# Altium schematic sheet STM32.SchDoc
size 297 x 210 mm
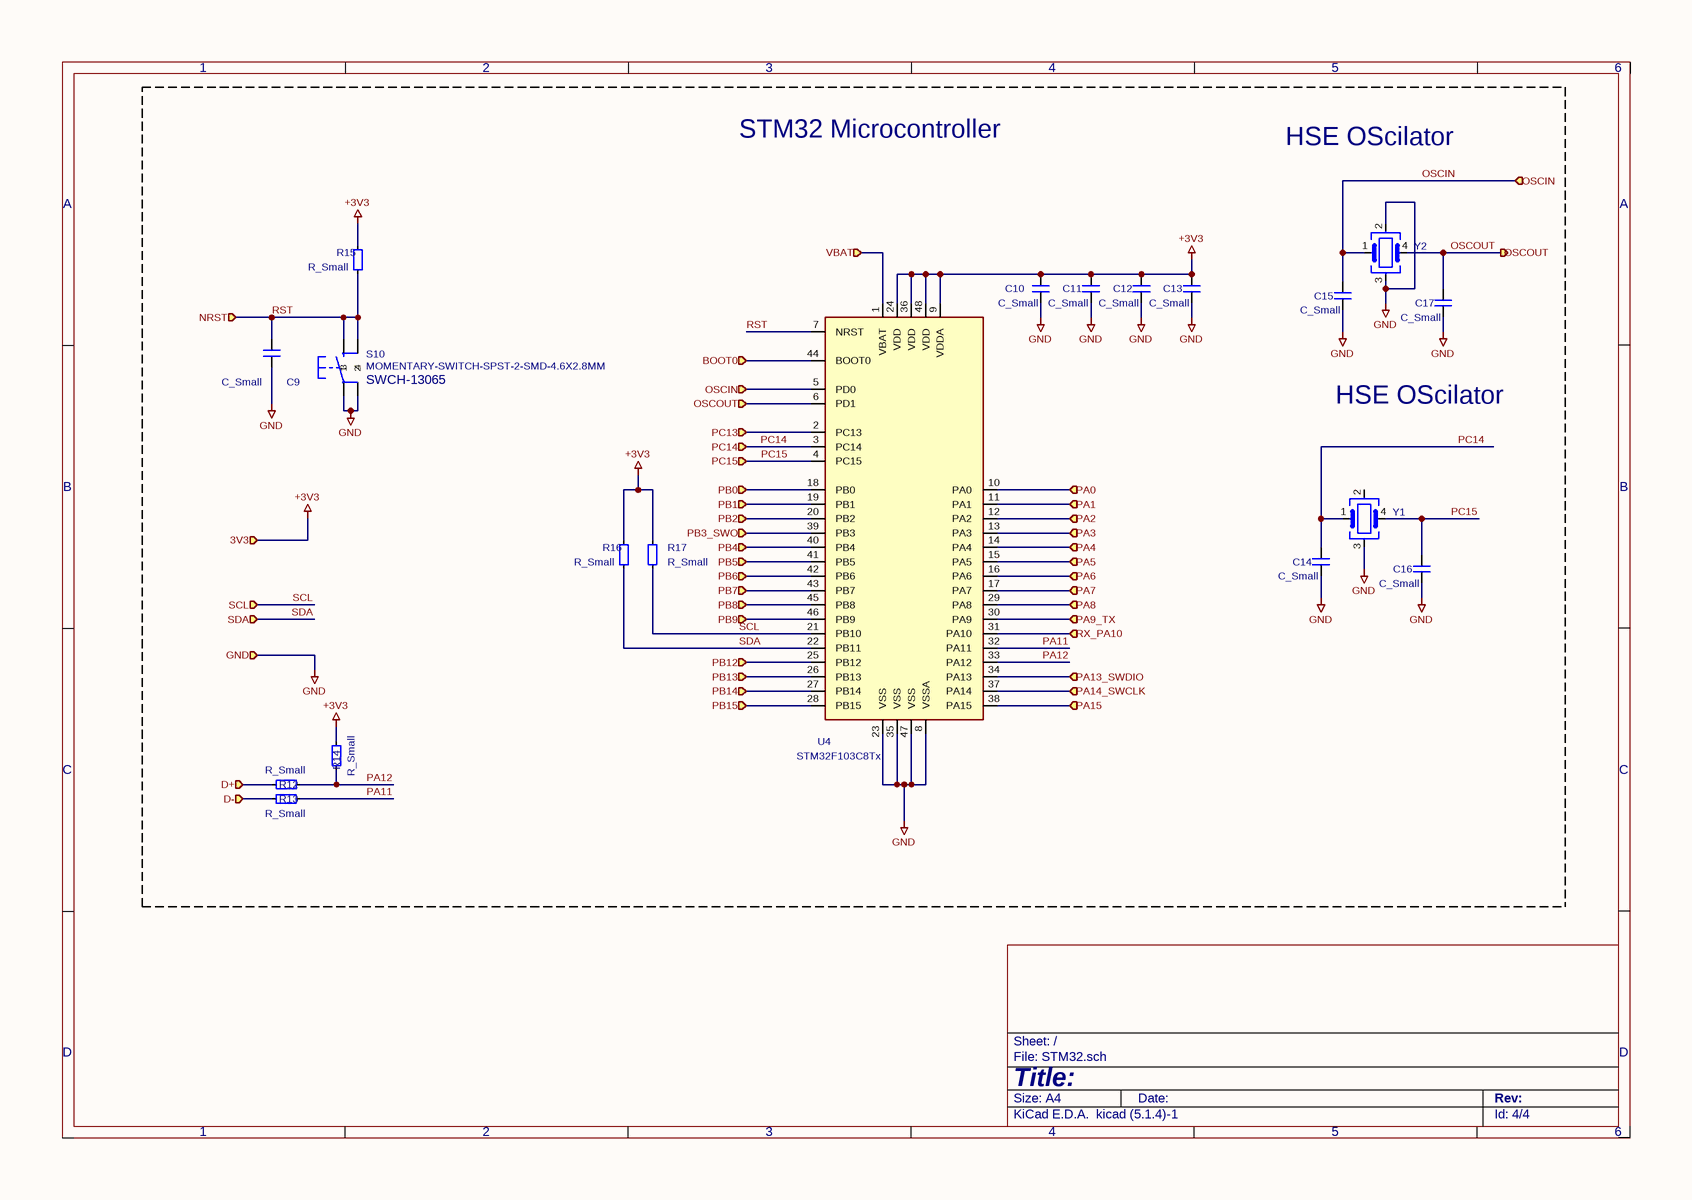
[diagram p0: STM32.SchDoc]

## Parts
C9  C_Small
C10  C_Small
C11  C_Small
C12  C_Small
C13  C_Small
C14  C_Small
C15  C_Small
C16  C_Small
C17  C_Small
R12  R_Small
R13  R_Small
R14  R_Small
R15  R_Small
R16  R_Small
R17  R_Small
S10  Field4: SWCH-13065  [TACTILE_SWITCH_SMD_4.6X2.8MM]  (hidden comment: MOMENTARY-SWITCH-SPST-2-SMD-4.6X2.8MM)
U4  STM32F103C8Tx  [LQFP-48_7x7mm_P0.5mm]
Y1  Crystal_GND23  (value not drawn)
Y2  Crystal_GND23  (value not drawn)

## Ports
3V3 (in), BOOT0 (in), D+ (in), D- (in), GND (in), NRST (in), OSCIN (in), OSCOUT (in), OSCOUT (out), PA0 (in), PA1 (in), PA2 (in), PA3 (in), PA4 (in), PA5 (in), PA6 (in), PA7 (in), PA8 (in), PA9_TX (in), PA13_SWDIO (in), PA14_SWCLK (in), PA15 (in), PB0 (in), PB1 (in), PB2 (in), PB3_SWO (in), PB4 (in), PB5 (in), PB6 (in), PB7 (in), PB8 (in), PB9 (in), PB12 (in), PB13 (in), PB14 (in), PB15 (in), PC13 (in), PC14 (in), PC15 (in), RX_PA10 (in), SCL (in), SDA (in), VBAT (in)

## Nets
+3V3: C10.1 C11.1 C12.1 C13.1 R14.2 R15.1 R16.1 R17.1 U4.9(VDDA) U4.24(VDD) U4.36(VDD) U4.48(VDD) ; port 3V3
GND: C9.2 C10.2 C11.2 C12.2 C13.2 C14.2 C15.2 C16.2 C17.2 S10.1 S10.2 U4.8(VSSA) U4.23(VSS) U4.35(VSS) U4.47(VSS) Y1.3 Y2.2 Y2.3 ; port GND
BOOT0: U4.44(BOOT0) ; port BOOT0
D+: R12.2 ; port D+
D-: R13.2 ; port D-
OSCIN: C15.1 U4.5(PD0) Y2.1 ; port OSCIN
OSCOUT: C17.1 U4.6(PD1) Y2.4 ; port OSCOUT
PA0: U4.10(PA0) ; port PA0
PA1: U4.11(PA1) ; port PA1
PA2: U4.12(PA2) ; port PA2
PA3: U4.13(PA3) ; port PA3
PA4: U4.14(PA4) ; port PA4
PA5: U4.15(PA5) ; port PA5
PA6: U4.16(PA6) ; port PA6
PA7: U4.17(PA7) ; port PA7
PA8: U4.29(PA8) ; port PA8
PA9_TX: U4.30(PA9) ; port PA9_TX
PA11: R13.1 U4.32(PA11)
PA12: R12.1 R14.1 U4.33(PA12)
PA13_SWDIO: U4.34(PA13) ; port PA13_SWDIO
PA14_SWCLK: U4.37(PA14) ; port PA14_SWCLK
PA15: U4.38(PA15) ; port PA15
PB0: U4.18(PB0) ; port PB0
PB1: U4.19(PB1) ; port PB1
PB2: U4.20(PB2) ; port PB2
PB3_SWO: U4.39(PB3) ; port PB3_SWO
PB4: U4.40(PB4) ; port PB4
PB5: U4.41(PB5) ; port PB5
PB6: U4.42(PB6) ; port PB6
PB7: U4.43(PB7) ; port PB7
PB8: U4.45(PB8) ; port PB8
PB9: U4.46(PB9) ; port PB9
PB12: U4.25(PB12) ; port PB12
PB13: U4.26(PB13) ; port PB13
PB14: U4.27(PB14) ; port PB14
PB15: U4.28(PB15) ; port PB15
PC13: U4.2(PC13) ; port PC13
PC14: C14.1 U4.3(PC14) Y1.1 ; port PC14
PC15: C16.1 U4.4(PC15) Y1.4 ; port PC15
RST: C9.1 R15.2 S10.3 S10.4 U4.7(NRST) ; port NRST
RX_PA10: U4.31(PA10) ; port RX_PA10
SCL: R17.2 U4.21(PB10) ; port SCL
SDA: R16.2 U4.22(PB11) ; port SDA
VBAT: U4.1(VBAT) ; port VBAT

Not connected (* = marked no-connect by the designer): Y1 2

## Notes on the sheet
- STM32 Microcontroller
- HSE OScilator
- 1
- 2
- 3
- 4
- 5
- 6
- A
- B
- C
- D
- Title:
- File: STM32.sch
- Sheet: /
- KiCad E.D.A.  kicad (5.1.4)-1
- Size: A4
- Date:
- Rev:
- Id: 4/4

## Library data of the parts
C9-C17 = C_Small: Value: C_Small
R12-R17 = R_Small: Value: R_Small
S10 = MOMENTARY-SWITCH-SPST-2-SMD-4.6X2.8MM: Value: MOMENTARY-SWITCH-SPST-2-SMD-4.6X2.8MM
U4 = STM32F103C8Tx: Value: STM32F103C8Tx; Footprint: Package_QFP:LQFP-48_7x7mm_P0.5mm
Y1 Y2 = Crystal_GND23: Value: Crystal_GND23